# EAGLE design CLCKbyBINKOSSS (EAGLE 9.7.0)
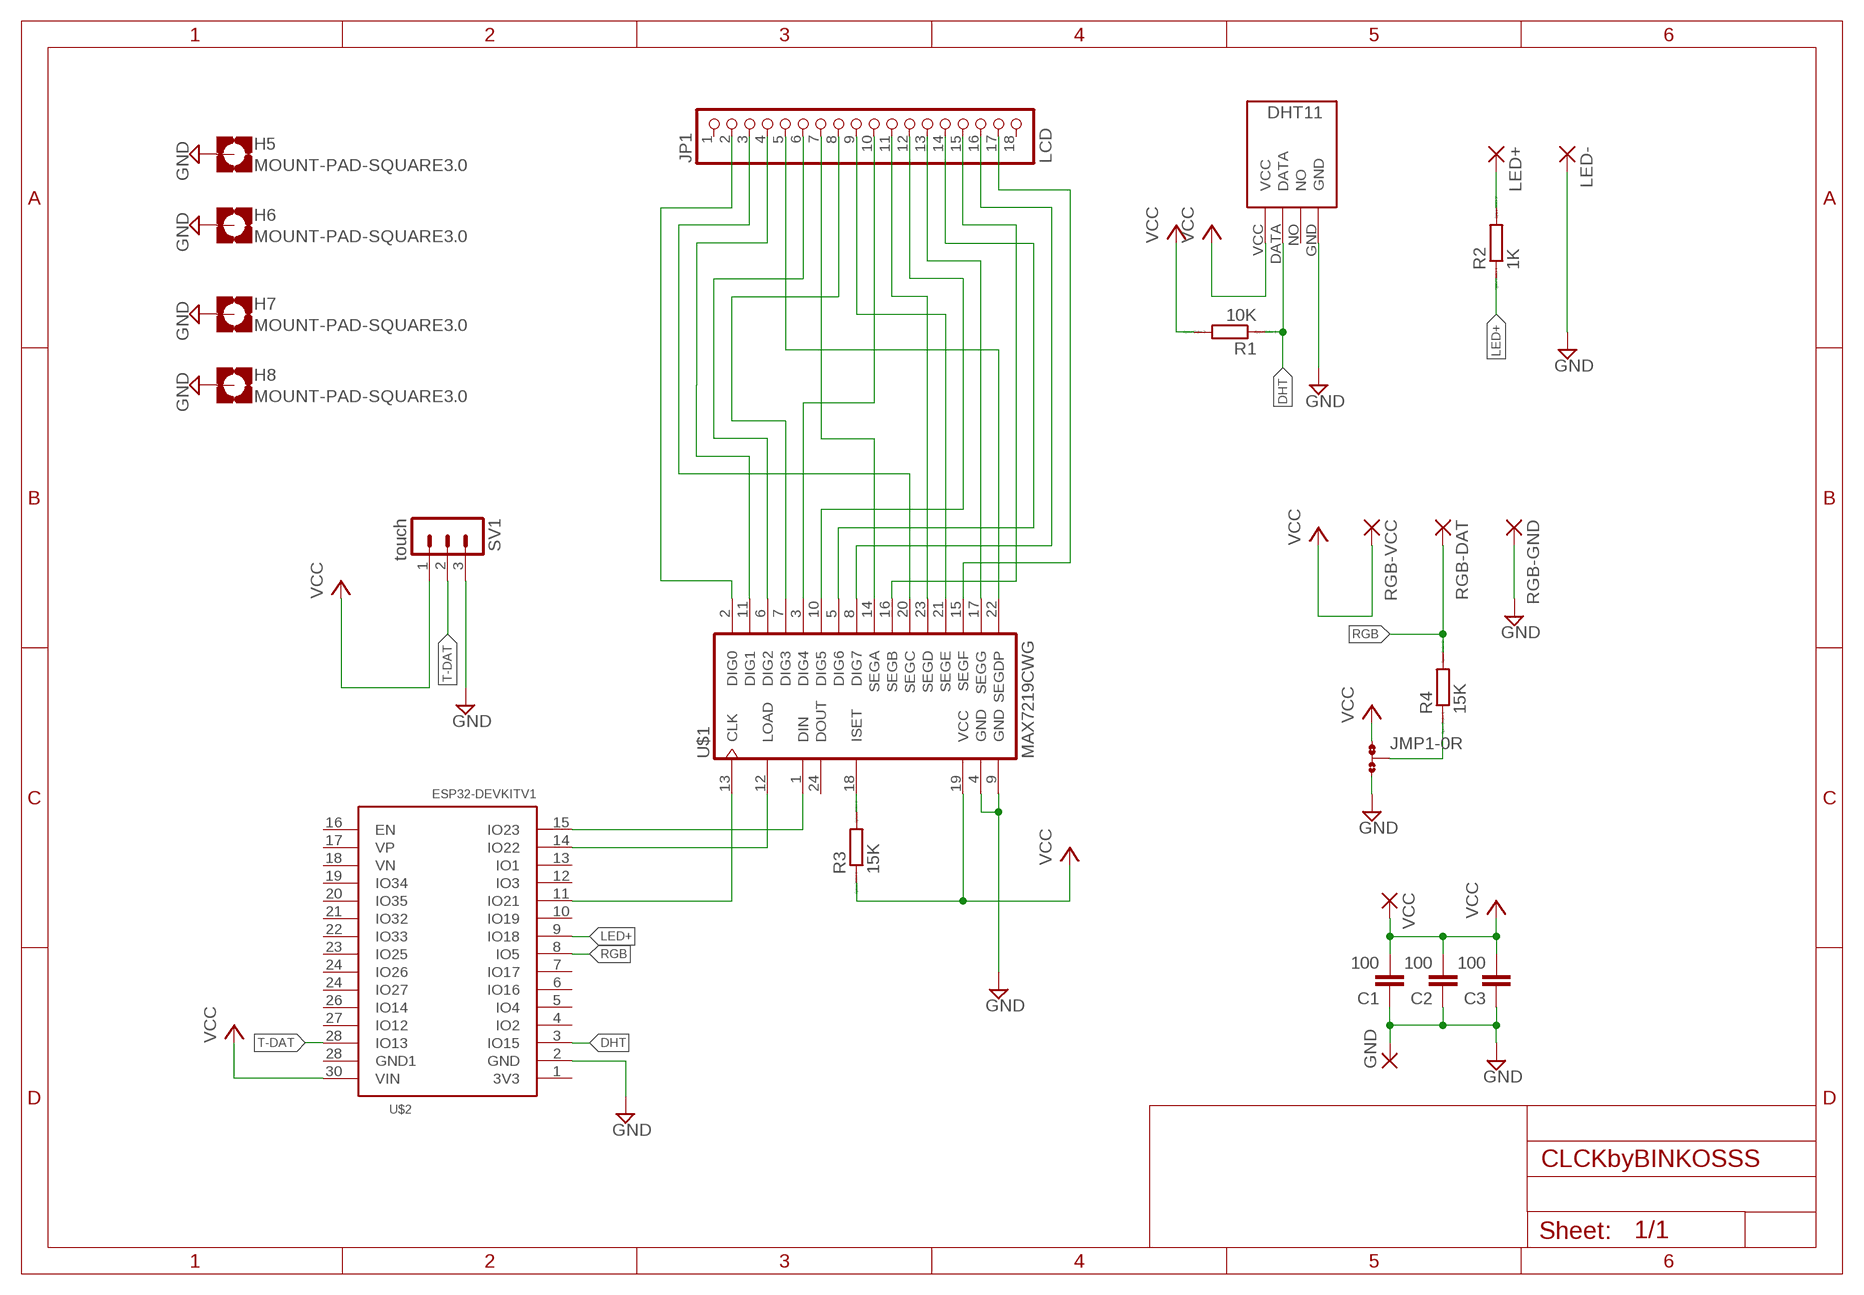
[diagram p0: schematic, sheet 1]

## Parts
C1  100  C-EUC1206  [C1206]
C2  100  C-EUC1206  [C1206]
C3  100  C-EUC1206  [C1206]
GND  WIREPADSMD1,27-254  [SMD1,27-2,54]
H5  MOUNT-PAD-SQUARE3.0  [3,0-PAD-SQUARE]
H6  MOUNT-PAD-SQUARE3.0  [3,0-PAD-SQUARE]
H7  MOUNT-PAD-SQUARE3.0  [3,0-PAD-SQUARE]
H8  MOUNT-PAD-SQUARE3.0  [3,0-PAD-SQUARE]
JMP1  0R-JUMPA  [A0R-JMP]
JP1  LCD  PINHD-1X18  [1X18]
LED+  WIREPADSMD1,27-254  [SMD1,27-2,54]
LED-  WIREPADSMD1,27-254  [SMD1,27-2,54]
R1  10K  RR1206  [R1206]
R2  1K  RR1206  [R1206]
R3  15K  RR1206  [R1206]
R4  15K  RR1206  [R1206]
RGB-DAT  WIREPADSMD1,27-254  [SMD1,27-2,54]
RGB-GND  WIREPADSMD1,27-254  [SMD1,27-2,54]
RGB-VCC  WIREPADSMD1,27-254  [SMD1,27-2,54]
SV1  touch  MA03-1  [MA03-1]
U$1  MAX7219CWG  [SO24L]
U$2  ESP32DEVKITV1  [ESP32-DEVKITV1]
U$3  DHT11-PION.  [DHT11-PION.]
VCC  WIREPADSMD1,27-254  [SMD1,27-2,54]

## Nets
DHT: R1.1 U$2.3(IO15) U$3.DATA
GND: C1.1 C2.1 C3.1 GND.1(P) H5.B3,0(MOUNT) H6.B3,0(MOUNT) H7.B3,0(MOUNT) H8.B3,0(MOUNT) JMP1.3 LED-.1(P) RGB-GND.1(P) SV1.3 U$1.4(GND) U$1.9(GND) U$2.2(GND) U$3.GND
LED+: R2.1 U$2.9(IO18)
N$1: R3.2 U$1.18(ISET)
N$2: U$1.1(DIN) U$2.15(IO23)
N$3: JP1.2 U$1.2(DIG0)
N$4: U$1.12(LOAD) U$2.14(IO22)
N$5: U$1.13(CLK) U$2.11(IO21)
N$6: JP1.14 U$1.5(DIG6)
N$7: JP1.3 U$1.20(SEGC)
N$8: JMP1.2 R4.1
N$9: LED+.1(P) R2.2
N$11: JP1.5 U$1.22(SEGDP)
N$12: JP1.6 U$1.6(DIG2)
N$13: JP1.7 U$1.14(SEGA)
N$14: JP1.8 U$1.7(DIG3)
N$15: JP1.9 U$1.21(SEGE)
N$16: JP1.10 U$1.3(DIG4)
N$17: JP1.15 U$1.16(SEGB)
N$18: JP1.11 U$1.23(SEGD)
N$19: JP1.12 U$1.10(DIG5)
N$20: JP1.13 U$1.17(SEGG)
N$21: JP1.16 U$1.8(DIG7)
N$22: JP1.17 U$1.15(SEGF)
N$23: JP1.4 U$1.11(DIG1)
RGB: R4.2 RGB-DAT.1(P) U$2.8(IO5)
T-DAT: SV1.2 U$2.28(IO13)
VCC: C1.2 C2.2 C3.2 JMP1.1 R1.2 R3.1 RGB-VCC.1(P) SV1.1 U$1.19(VCC) U$2.30(VIN) U$3.VCC VCC.1(P)
Unconnected: JP1.1 JP1.18 U$1.24(DOUT) U$2.1(3V3) U$2.4(IO2) U$2.5(IO4) U$2.6(IO16) U$2.7(IO17) U$2.10(IO19) U$2.12(IO3) U$2.13(IO1) U$2.16(EN) U$2.17(VP) U$2.18(VN) U$2.19(IO34) U$2.20(IO35) U$2.21(IO32) U$2.22(IO33) U$2.23(IO25) U$2.24(IO26) U$2.24(IO27) U$2.26(IO14) U$2.27(IO12) U$2.28(GND1) U$3.NO

## Library data of the parts
C1-C3 = rcl:C-EU: CAPACITOR, European symbol
GND LED+ LED- RGB-DAT RGB-GND RGB-VCC VCC = wirepad:WIREPAD: Wire PAD connect wire on PCB
H5-H8 = holes:MOUNT-PAD-SQUARE: MOUNTING PAD, square
JMP1 = jump-0r-smd:0R-JUMP: SMD 0R 0805 Jumper
JP1 = pinhead:PINHD-1X18: PIN HEADER
R1-R4 = eagle-ltspice:R: RESISTOR, European symbol; SPICEMODEL: NONE; SPICEPREFIX: R
SV1 = con-lstb:MA03-1: PIN HEADER; OC_FARNELL: unknown; OC_NEWARK: unknown
U$1 = max7219:MAX7219CWG
U$2 = ESP32-DEVKITV1:ESP32DEVKITV1
U$3 = DHT11:DHT11-PION.: DHT11 Czujnik temperatury i wilgotności (widok pionowy)

## Board
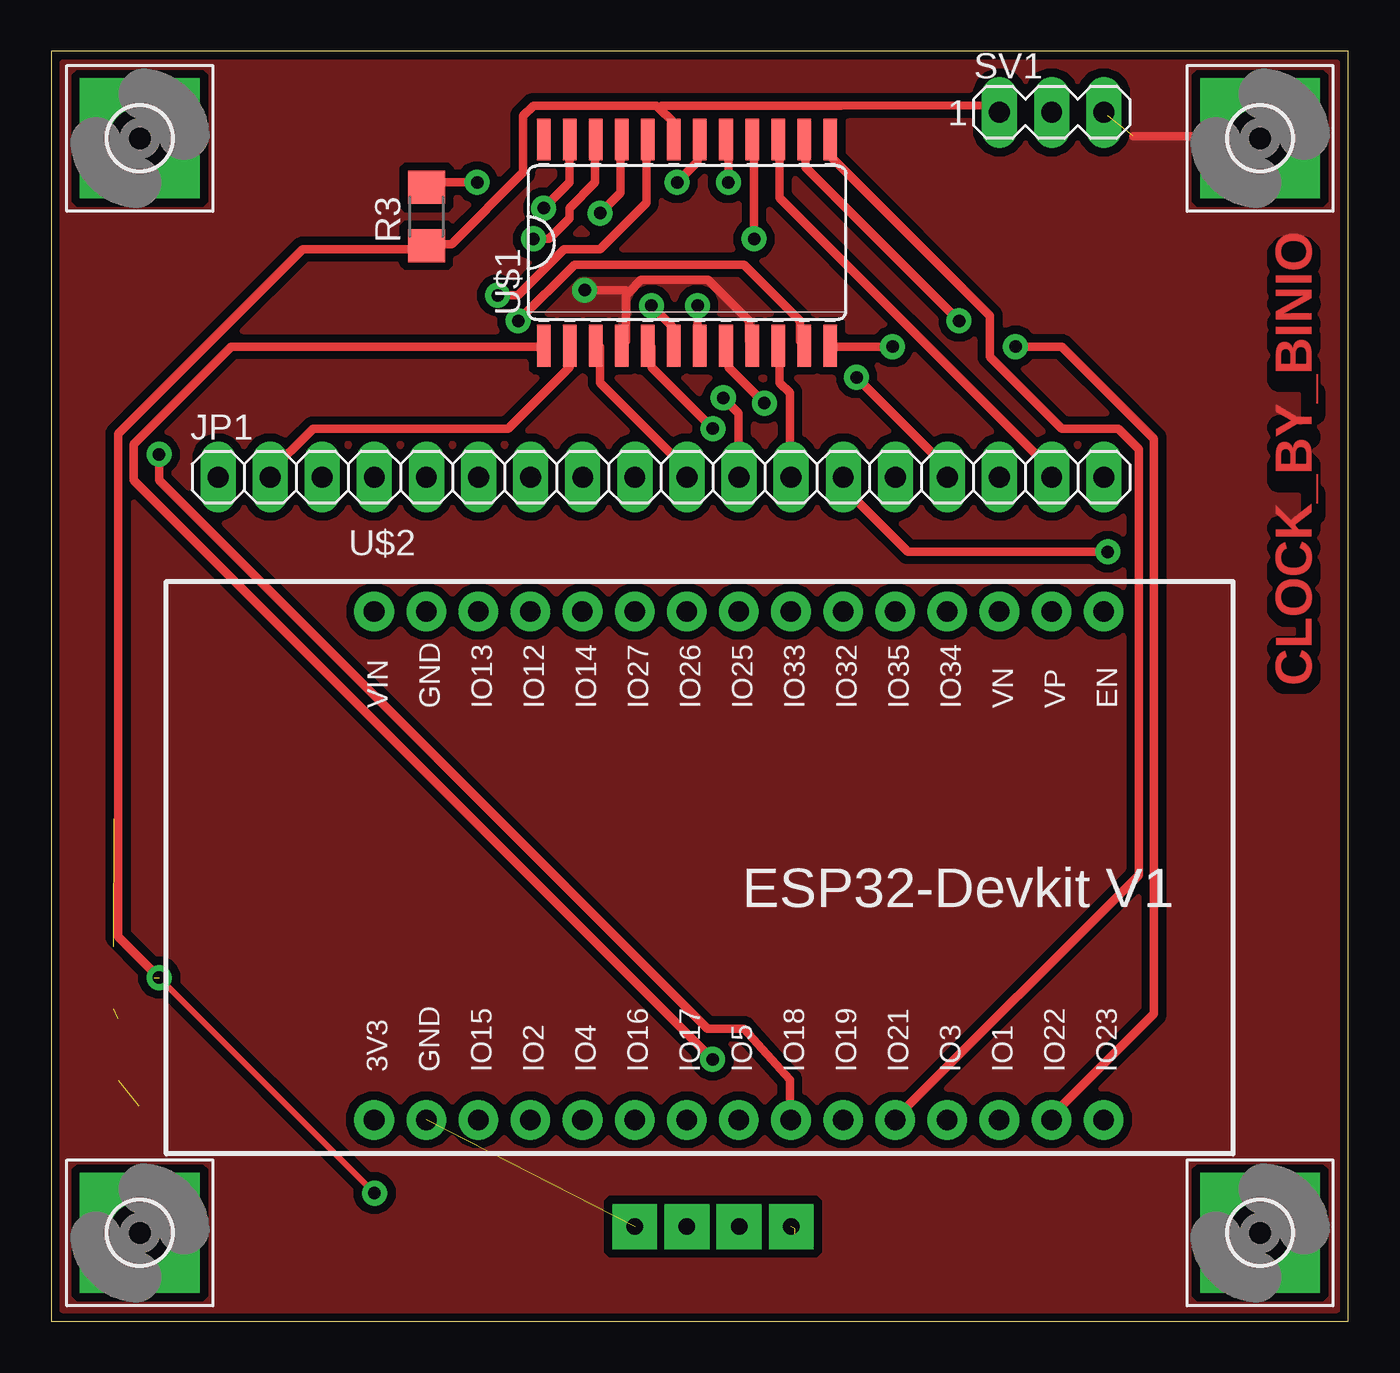
[diagram p1: board, top side]
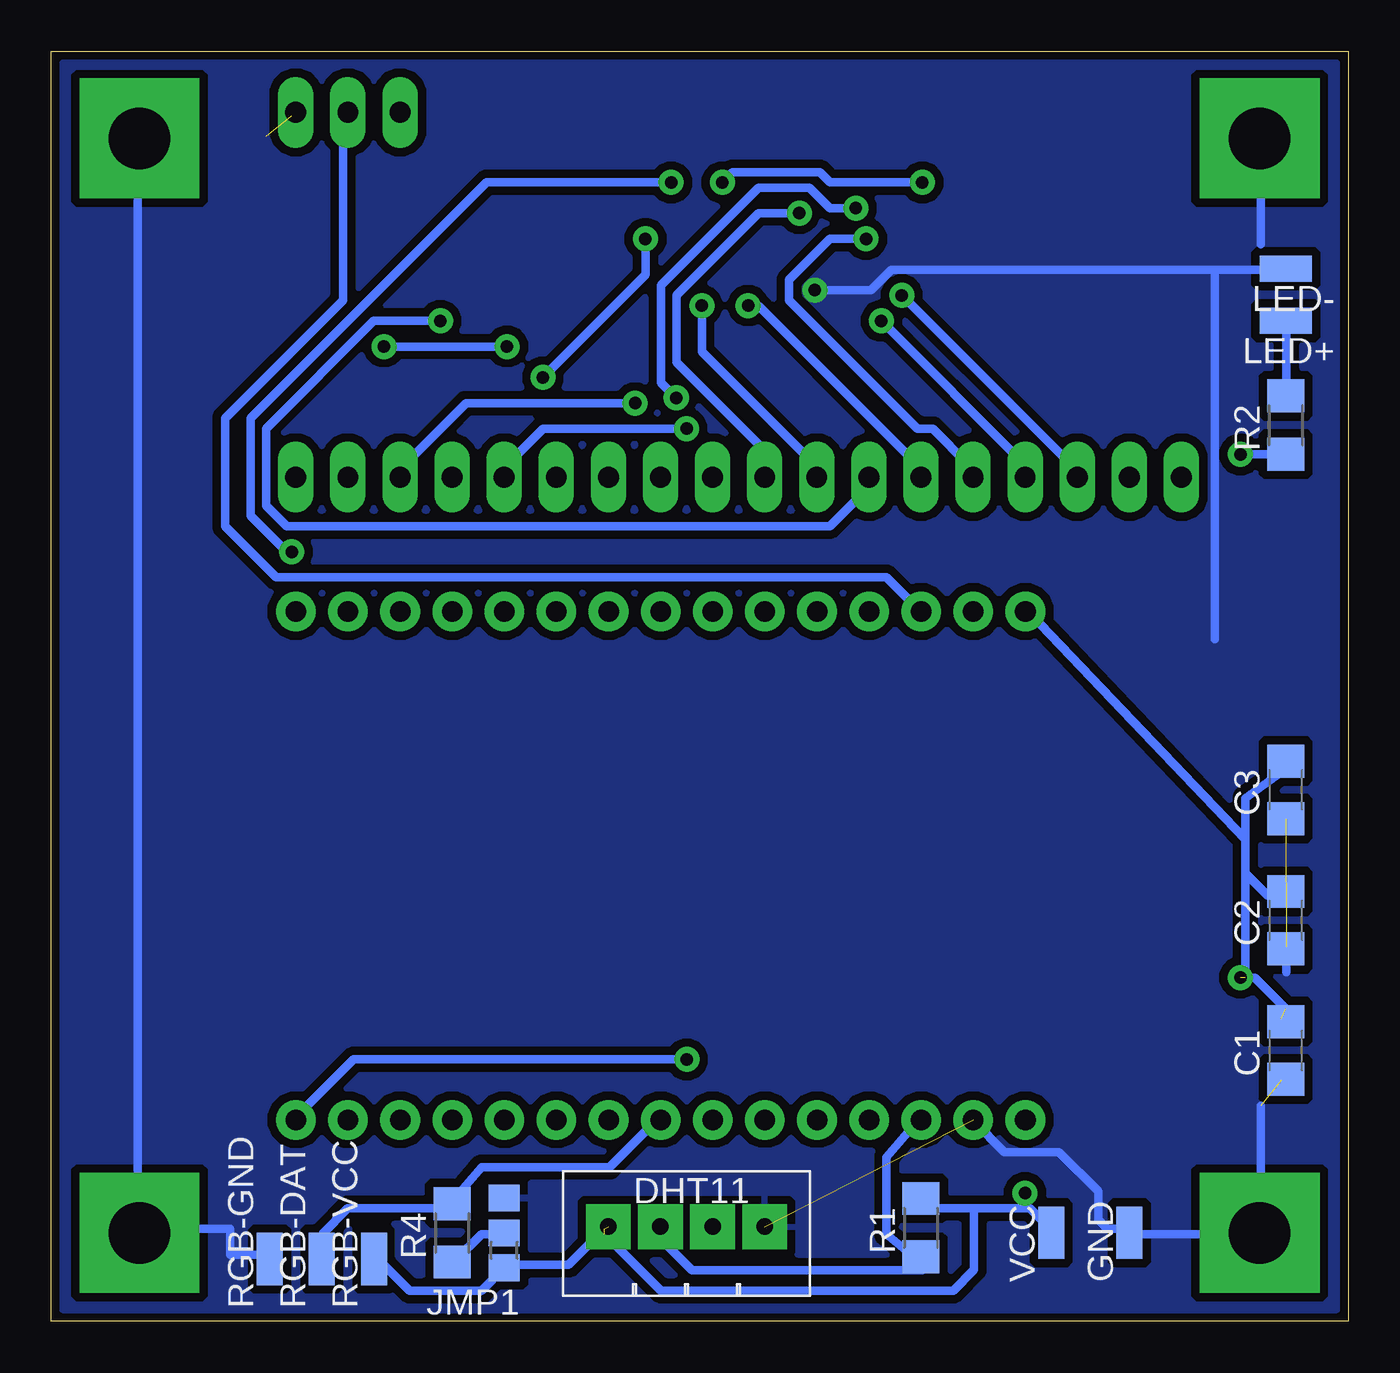
[diagram p2: board, bottom side, seen from below]

Size 63.23 x 61.9 mm. Coordinates in mm from the lower left corner, seen from the top.
Outline: 0,0 63.23,0 63.23,61.9 0,61.9 0,0
Copper layers (1*16): Top / Bottom
Stack-up Default Layer Stack: Top User Defined 0.035mm / Dielectric-1 User Defined 1.5mm / Bottom User Defined 0.035mm
Design rules: minimum copper width 16mil, minimum drill size 24mil, copper clearance wire_polygon to wire_polygon 12mil, copper clearance wire_polygon to pad_smd 12mil, copper clearance wire_polygon to via 12mil, copper clearance pad_smd to pad_smd 12mil, copper clearance pad_smd to via 12mil, copper clearance via to via 12mil, copper clearance smd to pad (same net) 12mil, copper clearance smd to via (same net) 12mil, copper clearance smd to smd (same net) 12mil, dimension clearance 16mil, via restrict clearance 0mil, restrict clearance 0mil, drill distance 8mil, keepout clearance 0mil

### Footprints (pad centres in the part's own frame; a part is rotated, then mirrored left to right if it is on the bottom)
C1206 = smd 1.6 x 1.8: 1 -1.4,0; 2 1.4,0
SMD1,27-2,54 = smd 1.27 x 2.54: 1 0,0
3,0-PAD-SQUARE = drill 3 pad 5.842 square: B3,0 0,0
A0R-JMP = smd 1.5 x 1.3: 1 0,1.7; 2 0,0; 3 0,-1.7
1X18 = drill 1.016 long: 1 -21.59,0; 2 -19.05,0; 3 -16.51,0; 4 -13.97,0; 5 -11.43,0; 6 -8.89,0; 7 -6.35,0; 8 -3.81,0; 9 -1.27,0; 10 1.27,0; 11 3.81,0; 12 6.35,0; 13 8.89,0; 14 11.43,0; 15 13.97,0; 16 16.51,0; 17 19.05,0; 18 21.59,0
R1206 = smd 1.6 x 1.803: 1 -1.422,0; 2 1.422,0
MA03-1 = drill 1.016 long: 1 -2.54,0; 2 0,0; 3 2.54,0
SO24L = smd 0.66 x 2.032: 1 -6.985,-5.029; 2 -5.715,-5.029; 3 -4.445,-5.029; 4 -3.175,-5.029; 5 -1.905,-5.029; 6 -0.635,-5.029; 7 0.635,-5.029; 8 1.905,-5.029; 9 3.175,-5.029; 10 4.445,-5.029; 11 5.715,-5.029; 12 6.985,-5.029; 13 6.985,5.029; 14 5.715,5.029; 15 4.445,5.029; 16 3.175,5.029; 17 1.905,5.029; 18 0.635,5.029; 19 -0.635,5.029; 20 -1.905,5.029; 21 -3.175,5.029; 22 -4.445,5.029; 23 -5.715,5.029; 24 -6.985,5.029
ESP32-DEVKITV1 = drill 1 pad 1.93: 1 -22.87,-13.54; 2 -20.33,-13.54; 3 -17.79,-13.54; 4 -15.25,-13.54; 5 -12.71,-13.54; 6 -10.17,-13.54; 7 -7.63,-13.54; 8 -5.09,-13.54; 9 -2.55,-13.54; 10 -0.01,-13.54; 11 2.53,-13.54; 12 5.07,-13.54; 13 7.61,-13.54; 14 10.15,-13.54; 15 12.69,-13.54; 16 12.69,11.23; 17 10.15,11.23; 18 7.61,11.23; 19 5.07,11.23; 20 2.53,11.23; 21 -0.01,11.23; 22 -2.55,11.23; 23 -5.09,11.23; 24 -7.63,11.23; 25 -10.17,11.23; 26 -12.71,11.23; 27 -15.25,11.23; 28 -17.79,11.23; 29 -20.33,11.23; 30 -22.87,11.23
DHT11-PION. = drill 0.8 pad 2.184 square: DATA -1.27,0.305; GND 3.81,0.305; NO 1.27,0.305; VCC -3.81,0.305

### Placement (x,y rotation side)
C1  3.05,13.21 90 bottom
C2  3.05,19.56 90 bottom
C3  3.05,25.91 90 bottom
GND  10.67,4.32 0 bottom
H5  4.32,4.32 0 top
H6  58.93,57.66 0 top
H7  58.93,4.32 0 top
H8  4.32,57.66 0 top
JMP1  41.15,4.32 180 bottom
JP1  29.72,41.15 0 top
LED+  3.05,48.77 90 bottom
LED-  3.05,51.31 90 bottom
R1  20.83,4.57 90 bottom
R2  3.05,43.69 90 bottom
R3  18.29,53.85 90 top
R4  43.69,4.32 90 bottom
RGB-DAT  50.04,3.05 0 bottom
RGB-GND  52.58,3.05 0 bottom
RGB-VCC  47.5,3.05 0 bottom
SV1  48.77,58.93 0 top
U$1  30.99,52.58 0 top
U$2  38.61,23.37 0 top
U$3  32.26,4.32 0 bottom
VCC  14.48,4.32 0 bottom

### Tracks (layer width: path | path; a pad name or v marks a point on that pad's centre or on a via)
DHT
  Bottom 0.406: U$2.3 21.01,9.76 22.51,8 22.51,4.26 21.01,3.01 R1.1 20.75,2.5 32,2.5 33.51,4.01 33.51,4.51 U$3.DATA
GND  (via drill 0.61)  (4 unrouted)
  Top 0.406: 28.13,50.13 28.76,50.76 32.01,50.76 34.01,48.76 34.01,47.76 U$1.9 | 28.13,50.13 28.01,50.01 28.01,47.76 U$1.4 | v26.01,50.26 28.01,50.26 28.13,50.13 | 52.76,57.76 58.76,57.76 H6.B3,0 | 51.51,58.76 SV1.3 | 58.93,6.26 H7.B3,0
  Bottom 0.406: 4.26,52.51 4.26,57.51 H8.B3,0 | 3.26,51.51 LED-.1 3.26,51.26 6.51,51.26 | v26.01,50.26 23.26,50.26 22.26,51.26 6.51,51.26 | 3.01,18.26 C2.1 3.01,18.01 3.01,17.01 | 3.01,24.51 C3.1 | 4.26,10.51 4.26,4.51 H5.B3,0 4.51,4.26 10.51,4.26 GND.1 10.76,4.51 11.75,4.51 12.19,4.95 12.19,6.35 14.1,8.26 16.76,8.26 18.26,9.76 U$2.2 | 3.26,11.76 C1.1 3.01,12.01 | RGB-GND.1 52.76,3.26 54.51,3.26 54.51,4.51 58.93,4.51 H7.B3,0 | 58.76,4.26 H7.B3,0 | H6.B3,0 59.01,57.51 59.01,4.51 H7.B3,0 | 6.51,33.26 6.51,51.26
  pour Top (isolate 0.406): 63.4,62.13 -0.15,62.13 -0.15,-0.15 63.4,-0.15
  pour Bottom (isolate 0.406): 63.4,62.13 -0.15,62.13 -0.15,-0.15 63.4,-0.15
LED+  (via drill 0.61)
  Top 0.406: v5.26,42.26 5.26,41.01 31.99,14.28 33.76,14.28 36.01,11.77 36.01,9.75 U$2.9
  Bottom 0.406: v5.26,42.26 3.26,42.26 R2.1
N$1  (via drill 0.61)
  Top 0.406: v20.76,55.51 18.51,55.51 R3.2 | v30.51,55.51 31.51,56.51 31.51,57.51 U$1.18
  Bottom 0.406: v20.76,55.51 25.26,55.51 25.76,56.01 30.01,56.01 v30.51,55.51
N$2  (via drill 0.61)
  Top 0.406: v32.24,12.77 4.01,41.01 4.01,42.76 8.76,47.51 23.76,47.51 U$1.1
  Bottom 0.406: v32.24,12.77 48.49,12.77 51.26,10.01 U$2.15
N$3
  Top 0.406: U$1.2 25.26,47.51 25.26,46.51 22.26,43.51 12.76,43.51 10.51,41.26 JP1.2
N$4  (via drill 0.61)
  Top 0.406: v41.01,47.51 38.01,47.51 U$1.12 | v47.01,47.51 49.26,47.51 53.76,43.01 53.76,15.01 48.76,10.01 U$2.14
  Bottom 0.406: v47.01,47.51 v41.01,47.51
N$5
  Top 0.406: U$1.13 38.01,57.51 38.01,56.76 45.76,49.01 45.76,47.01 49.26,43.51 52.01,43.51 53.01,42.51 53.01,21.76 41.26,10.01 U$2.11
N$6  (via drill 0.61)
  Top 0.406: v32.26,43.51 29.26,46.51 29.26,47.51 U$1.5
  Bottom 0.406: v32.26,43.51 39.26,43.51 41.01,41.76 41.01,41.26 JP1.14
N$7  (via drill 0.61)
  Top 0.406: v21.76,50.01 22.76,50.01 25.01,52.26 26.76,52.26 29.01,54.51 29.01,57.51 U$1.20
  Bottom 0.406: v21.76,50.01 13.01,41.26 JP1.3
N$8
  Bottom 0.406: JMP1.2 41.26,4.26 42.26,4.26 43.51,3.01 R4.1
N$9
  Bottom 0.406: R2.2 3.01,45.26 3.01,48.76 LED+.1
N$10
  pour Bottom (isolate 0.406): 63.4,62.13 -0.15,62.13 -0.15,-0.15 63.4,-0.15
N$11  (via drill 0.61)
  Top 0.406: v23.51,52.76 24.26,52.76 25.26,53.76 25.26,54.26 26.51,55.51 26.51,57.51 U$1.22
  Bottom 0.406: v23.51,52.76 25.26,52.76 27.26,50.76 27.26,49.76 21.01,43.51 20.26,43.51 18.51,41.76 18.51,41.26 JP1.5
N$12  (via drill 0.61)
  Top 0.406: v29.26,49.51 30.26,48.51 30.26,47.76 U$1.6
  Bottom 0.406: v29.26,49.51 28.76,49.51 21.01,41.76 21.01,41.26 JP1.6
N$13  (via drill 0.61)
  Top 0.406: v44.26,48.76 36.76,56.26 36.76,57.51 U$1.14
  Bottom 0.406: v44.26,48.76 47.51,48.76 52.76,43.51 52.76,39.76 51.76,38.76 25.26,38.76 23.51,40.51 23.51,41.01 JP1.7
N$14  (via drill 0.61)
  Top 0.406: v31.51,49.51 31.51,47.76 U$1.7
  Bottom 0.406: v31.51,49.51 31.51,47.26 26.01,41.76 26.01,41.26 JP1.8
N$15  (via drill 0.61)
  Top 0.406: v26.76,54.01 27.76,55.01 27.76,57.51 U$1.21
  Bottom 0.406: v26.76,54.01 28.76,54.01 32.76,50.01 32.76,46.76 28.51,42.51 28.51,41.26 JP1.9
N$16
  Top 0.406: U$1.3 26.76,47.51 26.76,45.76 30.76,41.76 30.76,41.26 JP1.10
N$17  (via drill 0.61)
  Top 0.406: v34.26,52.76 34.26,57.51 U$1.16 | v39.26,46.01 43.51,41.76 43.51,41.26 JP1.15
  Bottom 0.406: v34.26,52.76 34.26,51.01 v39.26,46.01
N$18  (via drill 0.61)
  Top 0.406: v24.01,54.26 25.26,55.51 25.26,57.51 U$1.23 | v32.76,45.01 33.51,44.26 33.51,41.26 JP1.11
  Bottom 0.406: v24.01,54.26 25.26,54.26 26.26,55.26 28.76,55.26 33.51,50.51 33.51,45.76 v32.76,45.01
N$19
  Top 0.406: U$1.10 35.51,47.51 35.51,45.76 36.01,45.26 36.01,41.26 JP1.12
N$20  (via drill 0.61)
  Top 0.406: v33.01,55.51 33.01,57.51 U$1.17 | v51.5,37.51 41.76,37.51 38.76,40.51 38.76,41.01 JP1.13
  Bottom 0.406: v33.01,55.51 42.01,55.51 53.51,44.01 53.51,39.26 51.76,37.51 v51.5,37.51
N$21  (via drill 0.61)
  Top 0.406: v34.76,44.76 33.01,46.51 33.01,47.51 U$1.8
  Bottom 0.406: v34.76,44.76 43.01,44.76 46.01,41.76 46.01,41.26 JP1.16
N$22
  Top 0.406: U$1.15 35.51,57.51 35.51,54.76 49.01,41.26 JP1.17
N$23  (via drill 0.61)
  Top 0.406: v22.76,48.76 25.51,51.51 33.76,51.51 36.51,48.76 36.51,47.76 U$1.11
  Bottom 0.406: v22.76,48.76 15.76,41.76 15.76,41.26 JP1.4
N$24
  pour Top (isolate 0.406): 63.4,62.13 -0.15,62.13 -0.15,-0.15 63.4,-0.15
RGB
  Bottom 0.406: RGB-DAT.1 50.01,4.27 48.77,5.51 43.76,5.51 R4.2 43.76,5.76 42.26,7.51 36,7.51 33.76,9.76 U$2.8
T-DAT
  Bottom 0.406: SV1.2 49.01,58.76 49.01,49.76 54.76,44.01 54.76,38.76 52.26,36.26 22.51,36.26 21.01,34.76 U$2.28
VCC  (via drill 0.61)  (4 unrouted)
  Top 0.305: v15.76,6.26 v5.26,16.76
  Top 0.406: 29.63,59.13 30.26,58.51 30.26,57.76 U$1.19 | 29.63,59.13 29.51,59.26 23.51,59.26 23.01,58.76 23.01,56.01 19.51,52.51 18.51,52.51 R3.1 18.26,52.26 12.26,52.26 3.26,43.26 3.26,18.76 v5.26,16.76 | SV1.1 46.01,59.01 45.87,59.26 38.51,59.26 29.76,59.26 29.63,59.13
  Bottom 0.406: 3.26,14.76 C1.2 | C2.2 3.26,20.76 3.93,20.76 5.02,21.84 | 5.02,23.51 5.02,25.51 3.26,26.76 3.26,27.26 C3.2 | 5.02,23.51 15.51,34.51 U$2.30 | 15.76,5.51 15.51,5.51 14.51,4.51 VCC.1 | 15.76,5.51 18.24,5.51 | 18.24,5.51 20.76,5.51 R1.2 | 36.26,4.51 38.01,2.76 41.01,2.76 JMP1.1 42.26,1.51 45.76,1.51 47.26,3.01 RGB-VCC.1 | 18.24,5.51 18.24,2.52 19.25,1.51 33.51,1.51 36.26,4.26 | 15.76,5.51 v15.76,6.26 | v5.26,16.76 4.57,16.76 3.05,15.24 | 5.02,16.75 5.02,21.84 | 5.02,21.84 5.02,23.51

### Text on the board
Top: CLOCK_BY_BINIO